# Altium schematic sheet Sheet2.SchDoc: Alimentation
size A4; Date: 25/11/2024; Author: Lucas Taraire; DrawnBy: Lucas Taraire; SheetNumber: 3; SheetTotal: 5
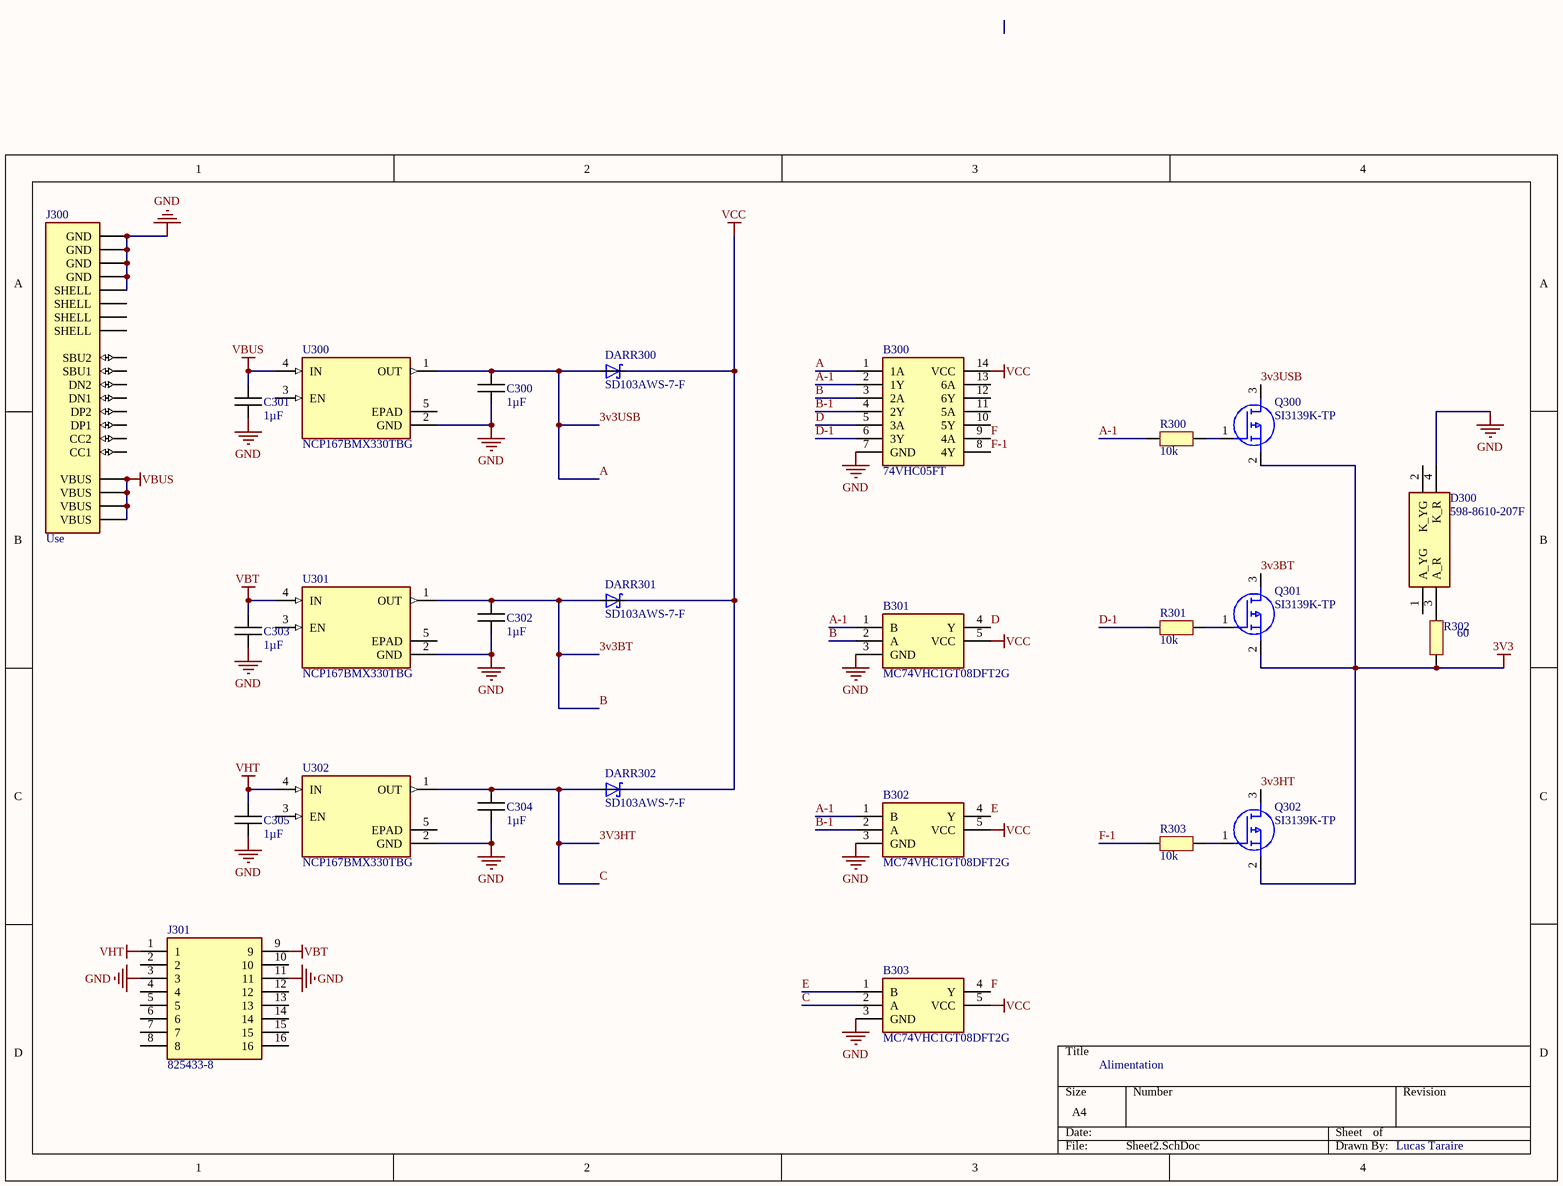
[diagram p0: Sheet2.SchDoc]

## Parts
B300  74VHC05FT  [SOP65P640X120-14N]
B301  MC74VHC1GT08DFT2G  [SOT65P210X110-5N]
B302  MC74VHC1GT08DFT2G  [SOT65P210X110-5N]
B303  MC74VHC1GT08DFT2G  [SOT65P210X110-5N]
C300  1µF  [CAPC1005X06N]
C301  1µF  [CAPC1005X06N]
C302  1µF  [CAPC1005X06N]
C303  1µF  [CAPC1005X06N]
C304  1µF  [CAPC1005X06N]
C305  1µF  [CAPC1005X06N]
D300  598-8610-207F  [5988610207F]
DARR300  SD103AWS-7-F  [SD103AWS-7-F]
DARR301  SD103AWS-7-F  [SD103AWS-7-F]
DARR302  SD103AWS-7-F  [SD103AWS-7-F]
J300  Use  [USB4085-GF-A]
J301  825433-8
Q300  SI3139K-TP  [SI3139K-TP]
Q301  SI3139K-TP  [SI3139K-TP]
Q302  SI3139K-TP  [SI3139K-TP]
R300  10k  [RESC1005X06N]
R301  10k  [RESC1005X06N]
R302  60  [RESC1005X06N]
R303  10k  [RESC1005X06N]
U300  NCP167BMX330TBG  [NCP167BMX330TBG]
U301  NCP167BMX330TBG  [NCP167BMX330TBG]
U302  NCP167BMX330TBG  [NCP167BMX330TBG]

## Nets
3V3: Q300.2(S) Q301.2(S) Q302.2(S) R302.1
GND: B300.7(GND) B301.3(GND) B302.3(GND) B303.3(GND) C300.2 C301.2 C302.2 C303.2 C304.2 C305.2 D300.4(K_R) J300.A1(GND) J300.A12(GND) J300.B1(GND) J300.B12(GND) J300.S4(SHELL) J301.3 J301.11 U300.2(GND) U301.2(GND) U302.2(GND)
VBT: C303.1 J301.9 U301.4(IN)
VBUS: C301.1 J300.A4(VBUS) J300.A9(VBUS) J300.B4(VBUS) J300.B9(VBUS) U300.4(IN)
VCC: B300.14(VCC) B301.5(VCC) B302.5(VCC) B303.5(VCC) DARR300.1(C) DARR301.1(C) DARR302.1(C)
VHT: C305.1 J301.1 U302.4(IN)
3v3BT: B300.3(2A) B301.2(A) C302.1 DARR301.2(A) Q301.3(D) U301.1(OUT)  [also labelled B]
3V3HT: B303.2(A) C304.1 DARR302.2(A) Q302.3(D) U302.1(OUT)  [also labelled C]
3v3USB: B300.1(1A) C300.1 DARR300.2(A) Q300.3(D) U300.1(OUT)  [also labelled A]
A-1: B300.2(1Y) B301.1(B) B302.1(B) R300.1
B-1: B300.4(2Y) B302.2(A)
D: B300.5(3A) B301.4(Y)
D-1: B300.6(3Y) R301.1
E: B302.4(Y) B303.1(B)
F: B300.9(4A) B303.4(Y)
F-1: B300.8(4Y) R303.1
NetQ300_1: Q300.1(G) R300.2
NetQ301_1: Q301.1(G) R301.2
NetQ302_1: Q302.1(G) R303.2

Not connected (* = marked no-connect by the designer): B300 10(5Y) 11(5A) 12(6Y) 13(6A); D300 1(A_YG) 2(K_YG) 3(A_R); J300 A5(CC1) A6(DP1) A7(DN1) A8(SBU1) B5(CC2) B6(DP2) B7(DN2) B8(SBU2) S1(SHELL) S2(SHELL) S3(SHELL); J301 2 4 5 6 7 8 10 12 13 14 15 16; R302 2; U300 3(EN) 5(EPAD); U301 3(EN) 5(EPAD); U302 3(EN) 5(EPAD)

## Library data of the parts
B300 = 74VHC05FT: Logic Gates CMOS LOGIC IC INVERTER; Manufacturer_Name: Toshiba; Manufacturer_Part_Number: 74VHC05FT; Mouser Part Number: 757-74VHC05FT
B301-B303 = MC74VHC1GT08DFT2G: Single 2-Input AND Gate, TTL Level; Manufacturer_Name: onsemi; Manufacturer_Part_Number: MC74VHC1GT08DFT2G; Parameter 3: *
C300-C305 = Capacitor
D300 = 598-8610-207F: Standard LEDs - SMD Red/Green WC 80/50mcd 645/570nm; Manufacturer_Name: Dialight; Geometry.Height: 0.8mm; Manufacturer_Part_Number: 598-8610-207F; Mouser Part Number: 645-598-8610-207F; Mouser Price/Stock: https://www.mouser.co.uk/ProductDetail/Dialight/598-8610-207F?qs=7JStj%2FjQ2SFuCjosqwklHQ%3D%3D; Arrow Part Number: 598-8610-207F; Arrow Price/Stock: https://www.arrow.com/en/products/598-8610-207f/dialight?region=nac; Datasheet Link: https://media.digikey.com/pdf/Data%20Sheets/Dialight%20PDFs/598%20Series%201210%20Pkg%20Bi-Color.pdf
DARR300-DARR302 = SD103AWS-7-F: Diode Array 3 Independent Schottky 40V 175mA Surface Mount 6-TSSOP, SC-88, SOT-363
J300 = USB4085-GF-A: Connecteurs USB USB Type C, 2.0, Rec, TH , G/F, RA , Top Mnt, T & R
J301 = Connect-Mikronus: Headers & Wire Housings 8P double for connection mikrobus; Manufacturer_Name: TE Connectivity; Manufacturer_Part_Number: 825433-8; Mouser Part Number: 571-825433-8
Q300-Q302 = SI3139K-TP: MOSFET P-Channel MOSFET
R300-R303 = Resistor
U300-U302 = NCP167BMX330TBG: Régulateurs de tension LDO LDO 700 MA ULTRA-LOW NOISE 3.3V